# EAGLE design rclights (EAGLE 6.4)
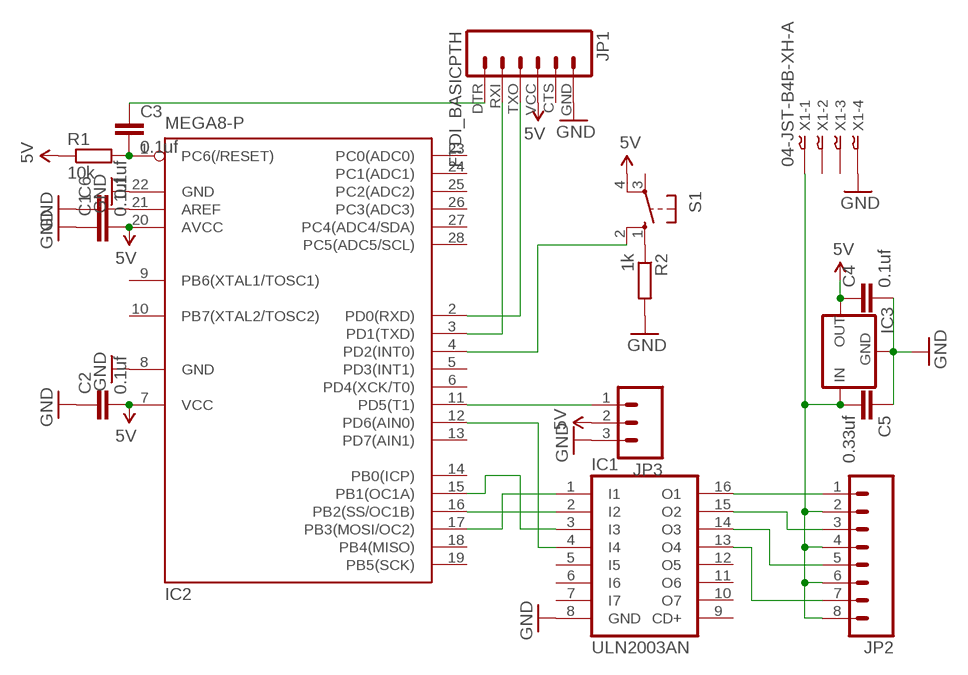
[diagram p0: schematic, sheet 1]

## Parts
C1  0.1uf  C-EU025-025X050  [C025-025X050]
C2  0.1uf  C-EU025-025X050  [C025-025X050]
C3  0.1uf  C-EU025-025X050  [C025-025X050]
C4  0.1uf  C-EU025-025X050  [C025-025X050]
C5  0.33uf  C-EU025-025X050  [C025-025X050]
C6  0.1uf  C-EU025-025X050  [C025-025X050]
IC1  ULN2003AN  [DIL16]
IC2  MEGA8-P  [DIL28-3]
IC3  V_REG_78XX-TO-220  [TO-220-ALT]
JP1  FTDI_BASICPTH  [FTDI_BASIC]
JP2  M081X08  [1X08]
JP3  M03PTH  [1X03]
R1  10k  R-EU_0207/10  [0207/10]
R2  1k  R-EU_0207/10  [0207/10]
S1  10-XX  [B3F-10XX]
X1  04-JST-B4B-XH-A  [B4B-XH]

## Nets
5V: C1.2 C2.2 C4.1 IC2.7(VCC) IC2.20(AVCC) IC3.OUT JP1.VCC JP3.2 R1.1 S1.4(P1)
GND: C1.1 C2.1 C4.2 C5.1 C6.1 IC1.8(GND) IC2.8(GND) IC2.22(GND) IC3.GND JP1.GND JP3.3 R2.2 X1.P$4
N$1: IC1.3(I3) IC2.15(PB1(OC1A))
N$2: IC1.2(I2) IC2.16(PB2(SS/OC1B))
N$3: R2.1 S1.1(S)
N$4: IC1.4(I4) IC2.12(PD6(AIN0))
N$5: C5.2 IC3.IN JP2.2 JP2.4 JP2.6 JP2.8 X1.P$1
N$6: IC2.4(PD2(INT0)) S1.2(S1)
N$7: C3.1 JP1.DTR
N$8: IC2.2(PD0(RXD)) JP1.TXO
N$9: C3.2 IC2.1(PC6(/RESET)) R1.2
N$10: IC2.3(PD1(TXD)) JP1.RXI
N$11: IC1.1(I1) IC2.17(PB3(MOSI/OC2))
N$12: C6.2 IC2.21(AREF)
N$13: IC1.16(O1) JP2.1
N$14: IC1.15(O2) JP2.3
N$15: IC1.14(O3) JP2.5
N$16: IC1.13(O4) JP2.7
RECEIVER: IC2.11(PD5(T1)) JP3.1
Unconnected: IC1.5(I5) IC1.6(I6) IC1.7(I7) IC1.9(CD+) IC1.10(O7) IC1.11(O6) IC1.12(O5) IC2.5(PD3(INT1)) IC2.6(PD4(XCK/T0)) IC2.9(PB6(XTAL1/TOSC1)) IC2.10(PB7(XTAL2/TOSC2)) IC2.13(PD7(AIN1)) IC2.14(PB0(ICP)) IC2.18(PB4(MISO)) IC2.19(PB5(SCK)) IC2.23(PC0(ADC0)) IC2.24(PC1(ADC1)) IC2.25(PC2(ADC2)) IC2.26(PC3(ADC3)) IC2.27(PC4(ADC4/SDA)) IC2.28(PC5(ADC5/SCL)) JP1.CTS S1.3(P) X1.P$2 X1.P$3

## Library data of the parts
C1-C6 = rcl:C-EU: CAPACITOR, European symbol
IC1 = uln-udn:ULN2003A: DRIVER ARRAY
IC2 = atmel:MEGA8-P: MICROCONTROLLER 8 Kbytes FLASH, 1 kbytes SRAM, 512 bytes EEPROM, USART, 4-channel 10 bit ADC, 2-channel 8 bit ADC Pin compatible with Atmega48, ATMega88, ATMega168 Source: avr.lbr; OC_FARNELL: unknown; OC_NEWARK: unknown
IC3 = SparkFun-PowerIC:V_REG_78XX: Voltage Regulator Standard 7805 5V regulator. IGO (Input Ground Output). Spark Fun Electronics SKU : COM-00107
JP1 = SparkFun-Connectors:FTDI_BASIC: FTDI Basic header with labels
JP2 = SparkFun-Connectors:M08: Header 8 Standard 8-pin 0.1" header. Use with straight break away headers (SKU : PRT-00116), right angle break away headers (PRT-00553), swiss pins (PRT-00743), machine pins (PRT-00117), and female headers (PRT-00115).
JP3 = SparkFun-Connectors:M03: Header 3 Standard 3-pin 0.1" header. Use with straight break away headers (SKU : PRT-00116), right angle break away headers (PRT-00553), swiss pins (PRT-00743), machine pins (PRT-00117), and female headers (PRT-00115). Molex polarized connector foot print use with SKU : PRT-08232 with associated crimp pins and housings.
R1 R2 = rcl:R-EU_: RESISTOR, European symbol
S1 = switch-omron:10-XX: OMRON SWITCH; MPN: B3F-1000; OC_FARNELL: 176432; OC_NEWARK: 36M3542
X1 = con-jst-xh:04-JST: JST CONNECTOR

## Net classes
0 default: width 0.457 mm, drill 0.508 mm, clearance 0.381 mm
1 other: width 0.406 mm, drill 0.508 mm, clearance 0.305 mm

## Board
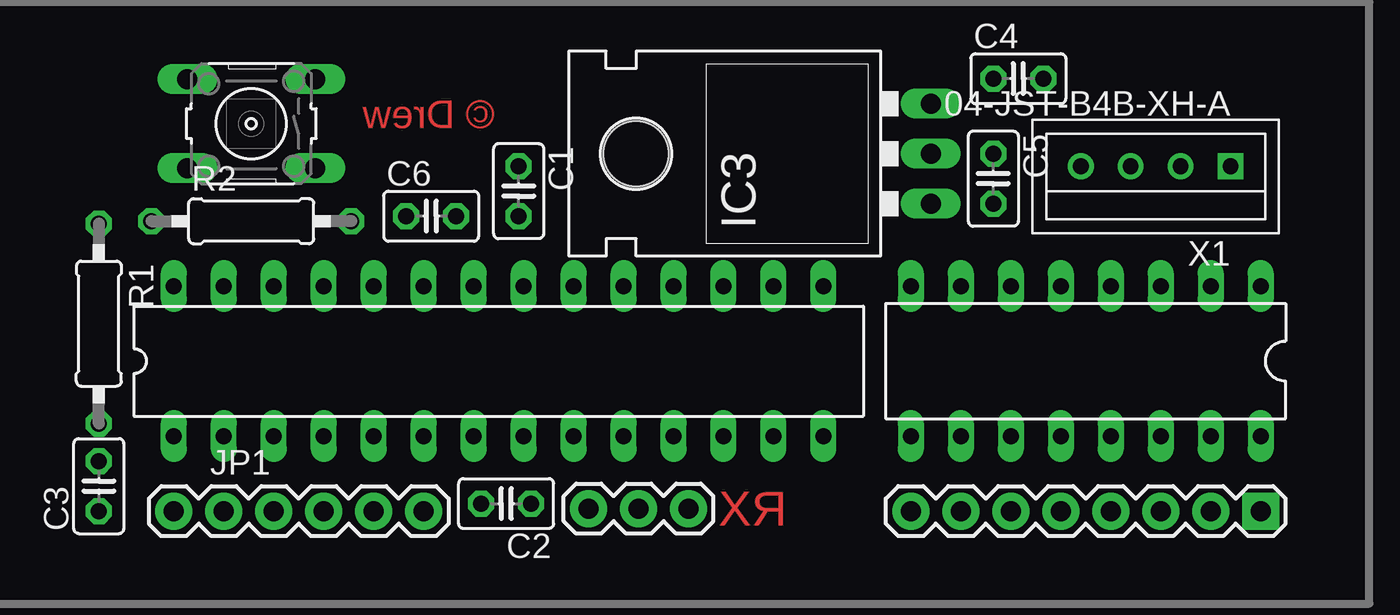
[diagram p1: board, top side]
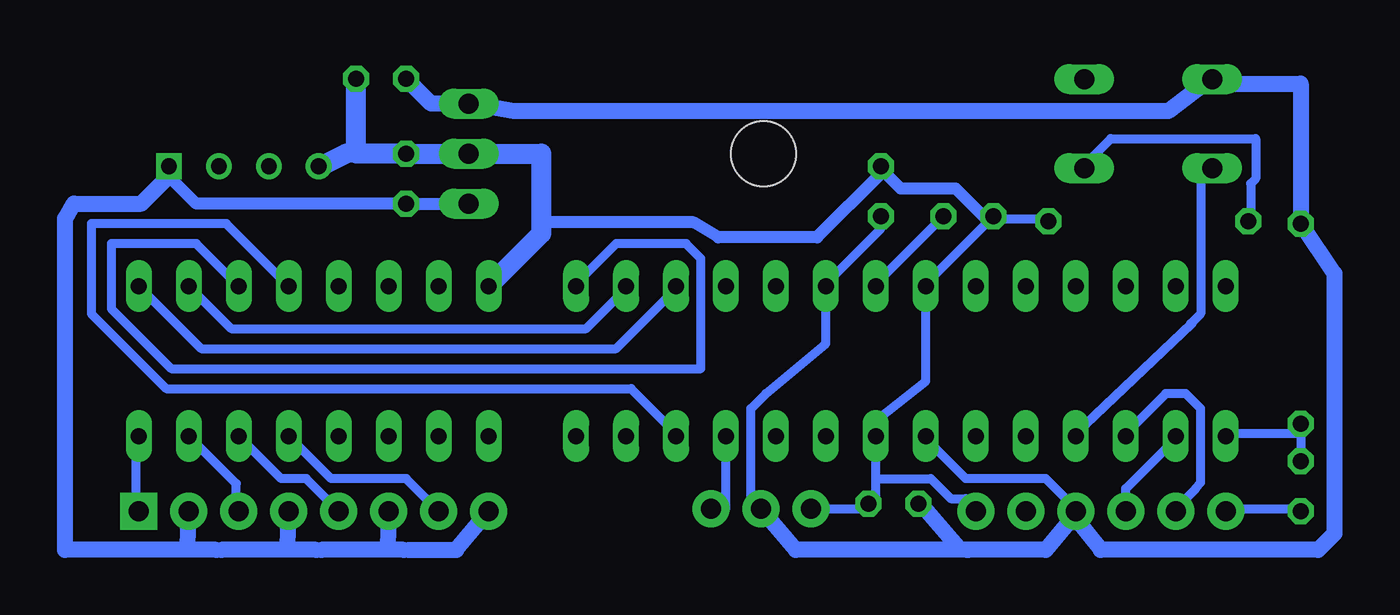
[diagram p2: board, bottom side, seen from below]

No outline drawn. Coordinates in mm, seen from the top.
Copper layers (1*16): Top 0.035mm / dielectric 1.5mm / Bottom 0.035mm
Design rules "default": minimum track width 10mil, minimum drill 24mil, track to track 8mil, track to pad 8mil, pad to pad 8mil, via to via 8mil, smd to smd 8mil, copper to edge 40mil, drill to drill 8mil, minimum pad ring 10mil, minimum via ring 8mil, stop-mask expansion 4mil, vias tented up to drill 0mil, thermal gap 10mil

### Footprints (pad centres in the part's own frame; a part is rotated, then mirrored left to right if it is on the bottom)
C025-025X050 = drill 0.813 octagon: 1 -1.27,0; 2 1.27,0
DIL16 = drill 0.813 long: 1 -8.89,-3.81; 2 -6.35,-3.81; 3 -3.81,-3.81; 4 -1.27,-3.81; 5 1.27,-3.81; 6 3.81,-3.81; 7 6.35,-3.81; 8 8.89,-3.81; 9 8.89,3.81; 10 6.35,3.81; 11 3.81,3.81; 12 1.27,3.81; 13 -1.27,3.81; 14 -3.81,3.81; 15 -6.35,3.81; 16 -8.89,3.81
DIL28-3 = drill 0.813 long: 1 -16.51,-3.81; 2 -13.97,-3.81; 3 -11.43,-3.81; 4 -8.89,-3.81; 5 -6.35,-3.81; 6 -3.81,-3.81; 7 -1.27,-3.81; 8 1.27,-3.81; 9 3.81,-3.81; 10 6.35,-3.81; 11 8.89,-3.81; 12 11.43,-3.81; 13 13.97,-3.81; 14 16.51,-3.81; 15 16.51,3.81; 16 13.97,3.81; 17 11.43,3.81; 18 8.89,3.81; 19 6.35,3.81; 20 3.81,3.81; 21 1.27,3.81; 22 -1.27,3.81; 23 -3.81,3.81; 24 -6.35,3.81; 25 -8.89,3.81; 26 -11.43,3.81; 27 -13.97,3.81; 28 -16.51,3.81
TO-220-ALT = drill 1.016 long: GND 0,-3.81; IN -2.54,-3.81; OUT 2.54,-3.81 | hole 3.302: 0,11.176
FTDI_BASIC = drill 1.016 pad 1.88: CTS 10.16,0; DTR 0,0; GND 12.7,0; RXI 2.54,0; TXO 5.08,0; VCC 7.62,0
1X08 = drill 1.016 pad 1.88 square: 1 0,0 | drill 1.016 pad 1.88: 2 2.54,0; 3 5.08,0; 4 7.62,0; 5 10.16,0; 6 12.7,0; 7 15.24,0; 8 17.78,0
1X03 = drill 1.016 pad 1.88: 1 0,0; 2 2.54,0; 3 5.08,0
0207/10 = drill 0.813 octagon: 1 -5.08,0; 2 5.08,0
B3F-10XX = drill 1.016 long: 1 -3.251,2.261; 2 3.251,2.261; 3 -3.251,-2.261; 4 3.251,-2.261
B4B-XH = drill 0.8 square: P$1 -3.81,0 | drill 0.8: P$2 -1.27,0; P$3 1.27,0; P$4 3.81,0

### Placement (x,y rotation side)
C1  31.75,20.95 270 top
C2  31.11,5.08 180 top
C3  10.41,5.97 90 top
C4  57.15,26.67 0 top
C5  55.88,21.59 270 top
C6  27.3,19.68 0 top
IC1  60.58,12.32 180 top
IC2  30.73,12.32 0 top
IC3  48.9,22.86 90 top
JP1  14.22,4.7 0 top
JP2  69.47,4.7 180 top
JP3  40.39,4.83 180 top
R1  10.41,14.22 270 top
R2  18.16,19.43 0 top
S1  18.16,24.38 180 top
X1  64.14,22.23 180 top

### Tracks (layer width: path | path; a pad name or v marks a point on that pad's centre or on a via)
5V
  Bottom 0.457: C1.2 31.75,19.05 34.54,16.26 IC2.20 34.54,13.21 37.59,10.67 38.35,9.91 38.35,5.14 JP3.2 | 27.37,2.73 27.81,2.86 27.3,2.73 | 29.72,5.08 C2.2 | 21.84,4.57 JP1.VCC | IC2.7 29.46,8.38 27.43,6.35 23.37,6.35 21.84,4.83 JP1.VCC | 14.73,26.42 S1.4 14.99,26.67 | 52.58,25.4 IC3.OUT | 21.84,4.32 JP1.VCC
  Bottom 0.813: 27.81,2.86 29.72,5.08 | 21.84,4.57 23.37,2.73 27.3,2.73 27.37,2.73 36.07,2.73 JP3.2 | C4.1 54.61,25.4 IC3.OUT | 14.73,26.42 10.41,26.42 R1.1 8.7,16.76 8.7,3.56 9.53,2.73 20.57,2.73 21.84,4.32 | 52.58,25.4 50.42,25.02 17.14,25.02 14.99,26.67
GND
  Bottom 0.457: 58.42,22.86 58.93,22.86 | 60.2,22.23 X1.P$4 | R2.2 23.37,19.56 25.91,19.56 C6.1 | C6.1 29.46,16.26 IC2.22 29.46,11.3 31.88,9.4 32,8.64 IC2.8 32,6.35 | 31.75,22.1 C1.1 31.75,21.84 | 26.42,19.56 C6.1 | JP3.3 32.77,4.83 32.51,5.08 C2.1 32,5.08 32,6.35 | 32,6.35 29.21,6.35 28.19,5.33 27.43,5.33 26.92,4.83 JP1.GND
  Bottom 0.61: 31.75,22.1 30.73,21.08 27.94,21.08 26.42,19.56 | 31.75,21.84 34.99,18.61 40.01,18.61 41.27,19.37 49.02,19.37
  Bottom 1.016: IC1.8 49.02,18.8 49.02,19.37 49.02,22.86 IC3.GND C5.1 58.42,22.86 C4.2 | 58.93,22.86 60.2,22.23
N$1
  Bottom 0.457: IC1.3 66.55,18.29 70.87,18.29 70.87,14.99 67.82,11.94 40.89,11.94 40.89,17.53 41.66,18.29 45.21,18.29 47.24,16.26 IC2.15
N$2
  Bottom 0.457: IC1.2 64.77,13.97 46.74,13.97 44.7,16 IC2.16
N$3
  Bottom 0.457: R2.1 12.95,19.56 12.95,21.34 12.7,21.59 12.7,23.62 20.07,23.62 21.34,22.35 S1.1
N$4
  Bottom 0.457: IC1.4 65.02,19.3 71.88,19.3 71.88,14.73 68.07,10.92 44.45,10.92 42.16,8.64 IC2.12
N$5
  Bottom 0.457: 67.82,21.59 X1.P$1 68.07,21.59 | 55.75,2.73 56.83,2.86 56.01,2.73 | 60.2,2.73 61.91,2.86 60.45,2.73 | 65.28,2.73 66.99,2.86 65.53,2.73
  Bottom 0.61: 67.82,21.59 66.55,20.32 C5.2 IC3.IN
  Bottom 0.813: JP2.8 53.34,2.73 55.75,2.73 | JP2.6 56.83,2.86 | 61.91,2.86 JP2.4 | 56.01,2.73 60.2,2.73 | 66.99,2.86 JP2.2 | 60.45,2.73 65.28,2.73 | 68.07,21.59 69.34,20.32 72.77,20.32 73.22,19.56 73.22,2.73 65.53,2.73
N$6
  Bottom 0.457: IC2.4 21.84,8.64 15.94,14.22 16,14.22 15.49,14.73 15.49,22.1 14.99,22.1 S1.2
N$7
  Bottom 0.457: C3.1 10.41,4.83 14.22,4.83 JP1.DTR
N$8
  Bottom 0.457: JP1.TXO 19.3,5.84 16.76,8.38 IC2.2
N$9
  Bottom 0.457: 10.41,8.64 C3.2 | 10.41,8.64 14.22,8.64 IC2.1 | 10.41,8.64 R1.2
N$10
  Bottom 0.457: IC2.3 19.3,8.64 17.27,10.67 16.26,10.67 15.49,9.91 15.49,6.16 15.75,5.84 16.76,4.83 JP1.RXI
N$11
  Bottom 0.457: IC1.1 66.29,12.95 45.21,12.95 42.16,16 IC2.17
N$12
  Bottom 0.457: C6.2 32,16.26 IC2.21
N$13
  Bottom 0.457: IC1.16 69.6,8.38 69.6,4.83 JP2.1
N$14
  Bottom 0.457: IC1.15 64.52,6.1 64.52,4.83 JP2.3
N$15
  Bottom 0.457: IC1.14 62.23,6.35 60.96,6.35 JP2.5
N$16
  Bottom 0.457: IC1.13 59.69,6.35 55.88,6.35 JP2.7
RECEIVER
  Bottom 0.457: IC2.11 39.62,4.83 JP3.1

### Text on the board
Top: © Drew | RX